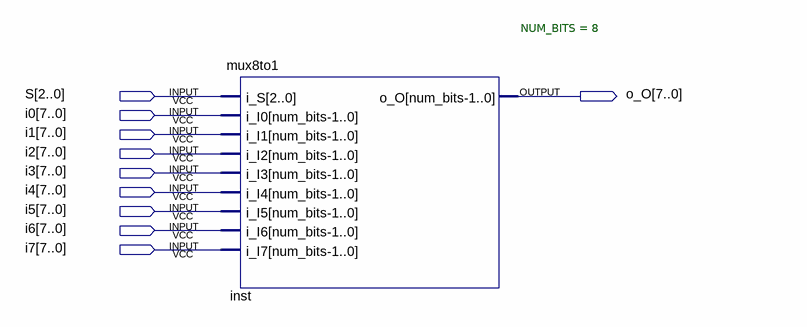
[diagram p0: schematic sheet]
// Quartus schematic mux8to1test.bdf as structural Verilog: 1 symbols, 10 pins
module mux8to1test (
  input  [2:0] S,
  input  [7:0] i0,
  input  [7:0] i1,
  input  [7:0] i2,
  input  [7:0] i3,
  input  [7:0] i4,
  input  [7:0] i5,
  input  [7:0] i6,
  input  [7:0] i7,
  output [7:0] o_O
);

  mux8to1 #(.NUM_BITS(8)) inst (
    .i_S(S), .i_I0(i0), .i_I1(i1), .i_I2(i2), .i_I3(i3), .i_I4(i4), .i_I5(i5), .i_I6(i6), .i_I7(i7), .o_O(o_O));
endmodule
